# EasyEDA Pro project color-spu-strip-1.1-1019.eprj

# Schematic Schematic1
Create Date: 2022-10-02; Page Name: P1; Project Name: color-spu-strip-1.0; Schematic Name: Schematic1; Update Date: 2022-10-12; Company: 嘉立创EDA; Drawed: jlywxy; Page Size: A4; Reviewed: jlywxy; Version: V1.0
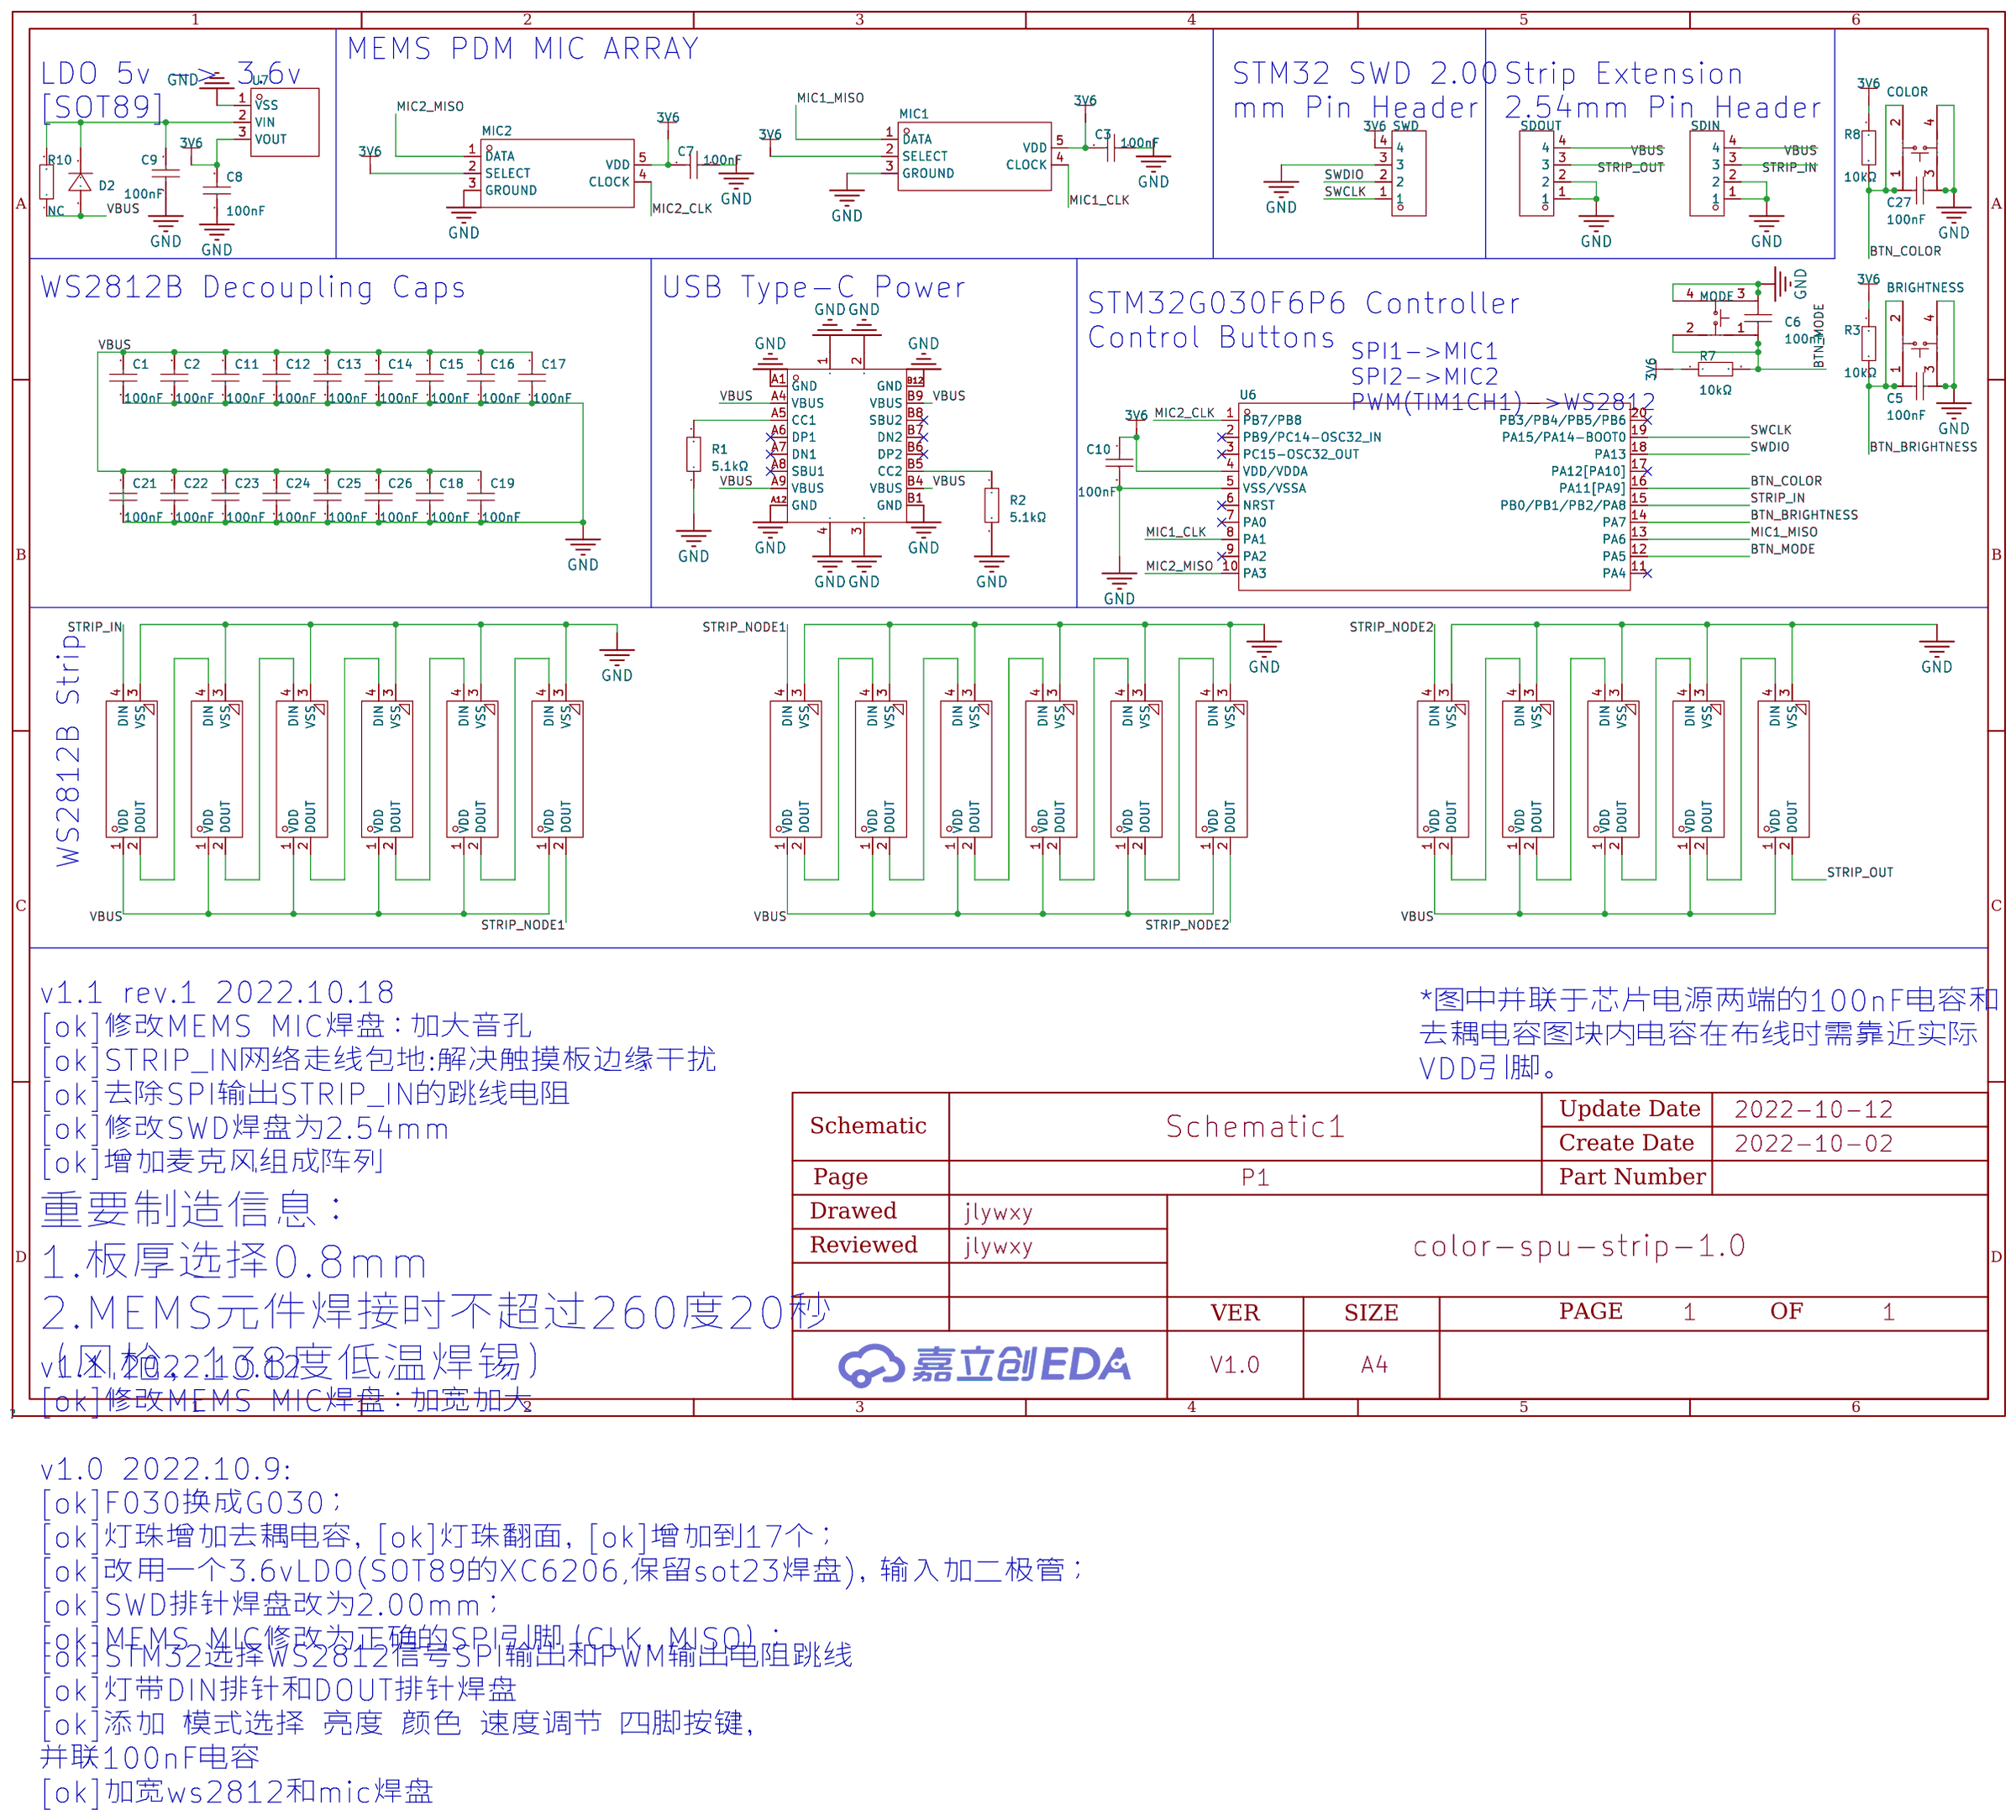
[diagram p0: schematic sheet]

## Parts
BRIGHTNESS  SKRPABE010  [KEY-SMD_4P-L4.2-W3.2-P2.20-LS4.6]
C1  100nF  [C0402]
C2  100nF  [C0402]
C3  100nF  [C0402]
C5  100nF  [C0402]
C6  100nF  [C0402]
C7  100nF  [C0402]
C8  100nF  [C0402]
C9  100nF  [C0402]
C10  100nF  [C0402]
C11  100nF  [C0402]
C12  100nF  [C0402]
C13  100nF  [C0402]
C14  100nF  [C0402]
C15  100nF  [C0402]
C16  100nF  [C0402]
C17  100nF  [C0402]
C18  100nF  [C0402]
C19  100nF  [C0402]
C21  100nF  [C0402]
C22  100nF  [C0402]
C23  100nF  [C0402]
C24  100nF  [C0402]
C25  100nF  [C0402]
C26  100nF  [C0402]
C27  100nF  [C0402]
COLOR  SKRPABE010  [KEY-SMD_4P-L4.2-W3.2-P2.20-LS4.6]
D2  M7  [DO-214AC_L4.3-W2.7-LS5.3-RD]
LED1  WS2812B-B  [LED-SMD_4P-L5.0-W5.0-TL_WS2812B-B]
LED2  WS2812B-B  [LED-SMD_4P-L5.0-W5.0-TL_WS2812B-B]
LED3  WS2812B-B  [LED-SMD_4P-L5.0-W5.0-TL_WS2812B-B]
LED4  WS2812B-B  [LED-SMD_4P-L5.0-W5.0-TL_WS2812B-B]
LED5  WS2812B-B  [LED-SMD_4P-L5.0-W5.0-TL_WS2812B-B]
LED6  WS2812B-B  [LED-SMD_4P-L5.0-W5.0-TL_WS2812B-B]
LED7  WS2812B-B  [LED-SMD_4P-L5.0-W5.0-TL_WS2812B-B]
LED8  WS2812B-B  [LED-SMD_4P-L5.0-W5.0-TL_WS2812B-B]
LED9  WS2812B-B  [LED-SMD_4P-L5.0-W5.0-TL_WS2812B-B]
LED10  WS2812B-B  [LED-SMD_4P-L5.0-W5.0-TL_WS2812B-B]
LED11  WS2812B-B  [LED-SMD_4P-L5.0-W5.0-TL_WS2812B-B]
LED12  WS2812B-B  [LED-SMD_4P-L5.0-W5.0-TL_WS2812B-B]
LED13  WS2812B-B  [LED-SMD_4P-L5.0-W5.0-TL_WS2812B-B]
LED14  WS2812B-B  [LED-SMD_4P-L5.0-W5.0-TL_WS2812B-B]
LED15  WS2812B-B  [LED-SMD_4P-L5.0-W5.0-TL_WS2812B-B]
LED16  WS2812B-B  [LED-SMD_4P-L5.0-W5.0-TL_WS2812B-B]
LED17  WS2812B-B  [LED-SMD_4P-L5.0-W5.0-TL_WS2812B-B]
MIC1  SPH0641LM4H-1  [MIC-SMD_5P_L3.5-W2.7-P0.82_SPH0641LU4H-1]
MIC2  SPH0641LM4H-1  [MIC-SMD_5P_L3.5-W2.7-P0.82_SPH0641LU4H-1]
MODE  SKRPABE010  [KEY-SMD_4P-L4.2-W3.2-P2.20-LS4.6]
R1  5.1kΩ  [R0603]
R2  5.1kΩ  [R0603]
R3  10kΩ  [R0603]
R7  10kΩ  [R0603]
R8  10kΩ  [R0603]
R10  NC  [R0603]
SDIN  M2510V-04P  [CONN-TH_M2510V-04P]
SDOUT  M2510V-04P  [CONN-TH_M2510V-04P]
SWD  M2510V-04P  [CONN-TH_M2510V-04P]
U2  20009-UCAF001-X  [TYPE-C-SMD_20009-UCAF001-X]
U6  STM32G030F6P6  [TSSOP-20_L6.5-W4.4-P0.65-LS6.4-BL]
U7  XC6206P362PR  [SOT-89-3_L4.5-W2.5-P1.50-LS4.2-BR]

## Library data of the parts
BRIGHTNESS COLOR MODE = SKRPABE010: 触点电流:50mA;额定电压(DC):16V;电路结构:单刀单掷;安装方式:立贴;按钮形状:椭圆形按钮;带灯:-;开关长度:4.2mm;开关宽度:3.2mm;开关高度:2.5mm;; LCSC Part Name: 3.2*4.2*2.5，1.57N; Supplier Part: C115360; Manufacturer: ALPSALPINE(阿尔卑斯阿尔派); Supplier Footprint: SMD; JLCPCB Part Class: Extended Part; Datasheet: https://atta.szlcsc.com/upload/public/pdf/source/20170620/1497944816225.pdf; Supplier: LCSC; Contact Current: 50mA; Voltage Rating (DC): 16V; Circuit: 单刀单掷; Mounting Style: 立贴; Actuator Style: 椭圆形按钮; Switch Length: 4.2mm; Switch Width: 3.2mm; Switch Height: 2.5mm
C1-C3 C5-C19 C21-C27 = CL05A105KP5NNNC: 容值:1uF;精度:±10%;额定电压:10V;材质(温度系数):X5R;; LCSC Part Name: 1uF ±10% 10V; Supplier Part: C14445; Manufacturer: SAMSUNG(三星); Supplier Footprint: 0402; JLCPCB Part Class: Extended Part; Datasheet: https://atta.szlcsc.com/upload/public/pdf/source/20160103/1457707670698.pdf; Supplier: LCSC; Tolerance: ±10%; Voltage Rated: 10V; Temperature Coefficient: X5R
D2 = M7_C95872: 二极管配置:-;直流反向耐压(Vr):1kV;平均整流电流(Io):1A;正向压降(Vf):1.1V@1A;反向电流(Ir):5A@1kV;; LCSC Part Name: 1kV 1A 1.1V@1A GPP; Supplier Part: C95872; Manufacturer: MDD; Supplier Footprint: SMA(DO-214AC); JLCPCB Part Class: Basic Part; Datasheet: https://atta.szlcsc.com/upload/public/pdf/source/20170221/1487670316366.pdf; Supplier: LCSC; Reverse Voltage (Vr): 1kV; Average Rectified Current (Io): 1A; Forward Voltage (Vf@If): 1.1V@1A; Reverse Leakage Current: 5A@1kV
LED1-LED17 = WS2812B-B: 发光颜色:RGB三色;; LCSC Part Name: RGB三色 （注意防潮，请查阅规格书中对应具体内容）; Supplier Part: C114586; Manufacturer: worldsemi; Supplier Footprint: 5050(mm); JLCPCB Part Class: Extended Part; Datasheet: https://atta.szlcsc.com/upload/public/pdf/source/20200615/C114586_26EB6813EC9F2A3F6C7FBB2AD75DE01F.pdf; Supplier: LCSC; Emitted Color: RGB三色
MIC1 MIC2 = SPH0641LM4H-1: Supplier Part: C497724; JLCPCB Part Class: Extended Part; Datasheet: https://atta.szlcsc.com/upload/public/pdf/source/20200318/C497724_6B11B238D0CA44BA5FB9A942A0F0F223.pdf; Supplier: LCSC
R1-R3 R7 R8 R10 = 0603WAF1002T5E: 电阻类型:厚膜电阻;阻值:10kΩ;精度:±1%;功率:100mW;温度系数:±100ppm/;最大工作电压:75V;工作温度范围:-55~+155;; LCSC Part Name: 10kΩ ±1% 100mW; Supplier Part: C25804; Manufacturer: UNI-ROYAL(厚声); Supplier Footprint: 0603; JLCPCB Part Class: Basic Part; Datasheet: https://atta.szlcsc.com/upload/public/pdf/source/20200306/C422600_1E6D84923E4A46A82E41ADD87F860B5C.pdf; Supplier: LCSC; Type: 厚膜电阻; Tolerance: ±1%; Power(Watts): 100mW; Temperature Coefficient: ±100ppm/; Overload Voltage (Max): 75V; Operating Temperature Range: -55~+155
SDIN SDOUT SWD = M2510V-04P: 参考系列:-;间距:2.54mm;插针结构:1x4P;排数:1;每排PIN数:4;行距:-;公母:公型插针;安装方式:直插;额定电流:3A;工作温度范围:-25~+85;; LCSC Part Name: 4P 2.54mm; Supplier Part: C2764792; Manufacturer: XFCN(台湾兴飞); Supplier Footprint: 插件,P=2.54mm; JLCPCB Part Class: Extended Part; Datasheet: https://atta.szlcsc.com/upload/public/pdf/source/20210810/3DC46818253F58AEF0903D89F89BDDDF.pdf; Supplier: LCSC; Pitch: 2.54mm; Pins Structure: 1x4P; Number of Rows: 1; Number of PINs Per Row: 4; Gender: 公型插针; Mounting Style: 直插; Current Rating (Max): 3A; Operating Temperature Range: -25~+85
U2 = 20009-UCAF001-X: TYPE C 16P母座板上 L=8.30; LCSC Part Name: TYPE C; Supplier Part: C3148200; Manufacturer: MINTRON(明硕); Supplier Footprint: SMD; JLCPCB Part Class: Extended Part; Datasheet: https://atta.szlcsc.com/upload/public/pdf/source/20220705/4C04992B6F70FB490BC74B4779796E6C.pdf; Supplier: LCSC
U6 = STM32G030F6P6: CPU位数:-;ROM类型:-;CPU内核:-;主频（MAX):-;工作电压:-;; Supplier Part: C724040; Manufacturer: ST(意法半导体); Supplier Footprint: TSSOP-20; JLCPCB Part Class: Extended Part; Datasheet: https://atta.szlcsc.com/upload/public/pdf/source/20200511/C529329_A1CB615556C746C4EA827FCAD1461480.pdf; Supplier: LCSC
U7 = XC6206P362PR: 输出类型:-;; Supplier Part: C545582; Manufacturer: UMW(友台半导体); Supplier Footprint: SOT-89; JLCPCB Part Class: Extended Part; Datasheet: https://atta.szlcsc.com/upload/public/pdf/source/20211011/2FF0EF86CD1346BC1578534D6C1D0E45.pdf; Supplier: LCSC

## Nets
3V6: C3.2 C7.2 C8.2 C10.1 MIC1.2(SELECT) MIC1.5(VDD) MIC2.2(SELECT) MIC2.5(VDD) R3.1 R7.1 R8.1 SWD.4 U6.4(VDD/VDDA) U7.3(VOUT)
GND: BRIGHTNESS.3 BRIGHTNESS.4 C1.1 C2.1 C3.1 C5.1 C6.1 C7.1 C8.1 C9.1 C10.2 C11.1 C12.1 C13.1 C14.1 C15.1 C16.1 C17.1 C18.1 C19.1 C21.1 C22.1 C23.1 C24.1 C25.1 C26.1 C27.1 COLOR.3 COLOR.4 LED1.3(VSS) LED2.3(VSS) LED3.3(VSS) LED4.3(VSS) LED5.3(VSS) LED6.3(VSS) LED7.3(VSS) LED8.3(VSS) LED9.3(VSS) LED10.3(VSS) LED11.3(VSS) LED12.3(VSS) LED13.3(VSS) LED14.3(VSS) LED15.3(VSS) LED16.3(VSS) LED17.3(VSS) MIC1.3(GROUND) MIC2.3(GROUND) MODE.3 MODE.4 R1.1 R2.2 SDIN.1 SDIN.2 SDOUT.1 SDOUT.2 SWD.3 U2.1 U2.2 U2.3 U2.4 U2.A1(GND) U2.A12(GND) U2.B1(GND) U2.B12(GND) U6.5(VSS/VSSA) U7.1(VSS)
VBUS: C1.2 C2.2 C11.2 C12.2 C13.2 C14.2 C15.2 C16.2 C17.2 C18.2 C19.2 C21.2 C22.2 C23.2 C24.2 C25.2 C26.2 D2.2(A) LED1.1(VDD) LED2.1(VDD) LED3.1(VDD) LED4.1(VDD) LED5.1(VDD) LED6.1(VDD) LED7.1(VDD) LED8.1(VDD) LED9.1(VDD) LED10.1(VDD) LED11.1(VDD) LED12.1(VDD) LED13.1(VDD) LED14.1(VDD) LED15.1(VDD) LED16.1(VDD) LED17.1(VDD) R10.1 SDIN.4 SDOUT.4 U2.A4(VBUS) U2.A9(VBUS) U2.B4(VBUS) U2.B9(VBUS)
BTN_BRIGHTNESS: BRIGHTNESS.1 BRIGHTNESS.2 C5.2 R3.2 U6.14(PA7)
BTN_COLOR: C27.2 COLOR.1 COLOR.2 R8.2 U6.16(PA11[PA9])
BTN_MODE: C6.2 MODE.1 MODE.2 R7.2 U6.12(PA5)
MIC1_CLK: MIC1.4(CLOCK) U6.8(PA1)
MIC1_MISO: MIC1.1(DATA) U6.13(PA6)
MIC2_CLK: MIC2.4(CLOCK) U6.1(PB7/PB8)
MIC2_MISO: MIC2.1(DATA) U6.10(PA3)
STRIP_IN: LED1.4(DIN) SDIN.3 U6.15(PB0/PB1/PB2/PA8)
STRIP_NODE1: LED6.2(DOUT) LED7.4(DIN)
STRIP_NODE2: LED12.2(DOUT) LED13.4(DIN)
STRIP_OUT: LED17.2(DOUT) SDOUT.3
SWCLK: SWD.1 U6.19(PA15/PA14-BOOT0)
SWDIO: SWD.2 U6.18(PA13)
$1N8535: R1.2 U2.A5(CC1)
$1N8835: R2.1 U2.B5(CC2)
$1N25428: LED1.2(DOUT) LED2.4(DIN)
$1N25469: LED2.2(DOUT) LED3.4(DIN)
$1N25510: LED3.2(DOUT) LED4.4(DIN)
$1N25551: LED4.2(DOUT) LED5.4(DIN)
$1N25592: LED5.2(DOUT) LED6.4(DIN)
$1N26919: LED7.2(DOUT) LED8.4(DIN)
$1N26920: LED8.2(DOUT) LED9.4(DIN)
$1N26921: LED9.2(DOUT) LED10.4(DIN)
$1N26922: LED10.2(DOUT) LED11.4(DIN)
$1N26923: LED11.2(DOUT) LED12.4(DIN)
$1N28420: LED13.2(DOUT) LED14.4(DIN)
$1N28421: LED14.2(DOUT) LED15.4(DIN)
$1N28422: LED15.2(DOUT) LED16.4(DIN)
$1N28423: LED16.2(DOUT) LED17.4(DIN)
$1N125570: C9.2 D2.1(K) R10.2 U7.2(VIN)

Not connected (* = marked no-connect by the designer): U2 A6(DP1)* A7(DN1)* A8(SBU1)* B6(DP2)* B7(DN2)* B8(SBU2)*; U6 2(PB9/PC14-OSC32_IN)* 3(PC15-OSC32_OUT)* 6(NRST)* 7(PA0)* 9(PA2)* 11(PA4)* 17(PA12[PA10])* 20(PB3/PB4/PB5/PB6)*

## Notes on the sheet
- LDO 5v -> 3.6v
  [SOT89]
- MEMS PDM MIC ARRAY
- STM32 SWD 2.00
  mm Pin Header
- Strip Extension
  2.54mm Pin Header
- WS2812B Decoupling Caps
- USB Type-C Power
- STM32G030F6P6 Controller
  Control Buttons
- SPI1->MIC1
  SPI2->MIC2
  PWM(TIM1CH1)->WS2812
- WS2812B Strip
- v1.1 rev.1 2022.10.18
  [ok]修改MEMS MIC焊盘：加大音孔
  [ok]STRIP_IN网络走线包地:解决触摸板边缘干扰
  [ok]去除SPI输出STRIP_IN的跳线电阻
  [ok]修改SWD焊盘为2.54mm
  [ok]增加麦克风组成阵列
- *图中并联于芯片电源两端的100nF电容和
  去耦电容图块内电容在布线时需靠近实际
  VDD引脚。
- 重要制造信息：
  1.板厚选择0.8mm
  2.MEMS元件焊接时不超过260度20秒
  （风枪，138度低温焊锡）
- v1.1 2022.10.12
  [ok]修改MEMS MIC焊盘：加宽加大
- v1.0 2022.10.9:
  [ok]F030换成G030；
  [ok]灯珠增加去耦电容，[ok]灯珠翻面，[ok]增加到17个；
  [ok]改用一个3.6vLDO(SOT89的XC6206,保留sot23焊盘)，输入加二极管；
  [ok]SWD排针焊盘改为2.00mm；
  [ok]MEMS MIC修改为正确的SPI引脚（CLK，MISO）；
- [ok]STM32选择WS2812信号SPI输出和PWM输出电阻跳线
  [ok]灯带DIN排针和DOUT排针焊盘
  [ok]添加 模式选择 亮度 颜色 速度调节 四脚按键，
  并联100nF电容
  [ok]加宽ws2812和mic焊盘

# Board PCB1
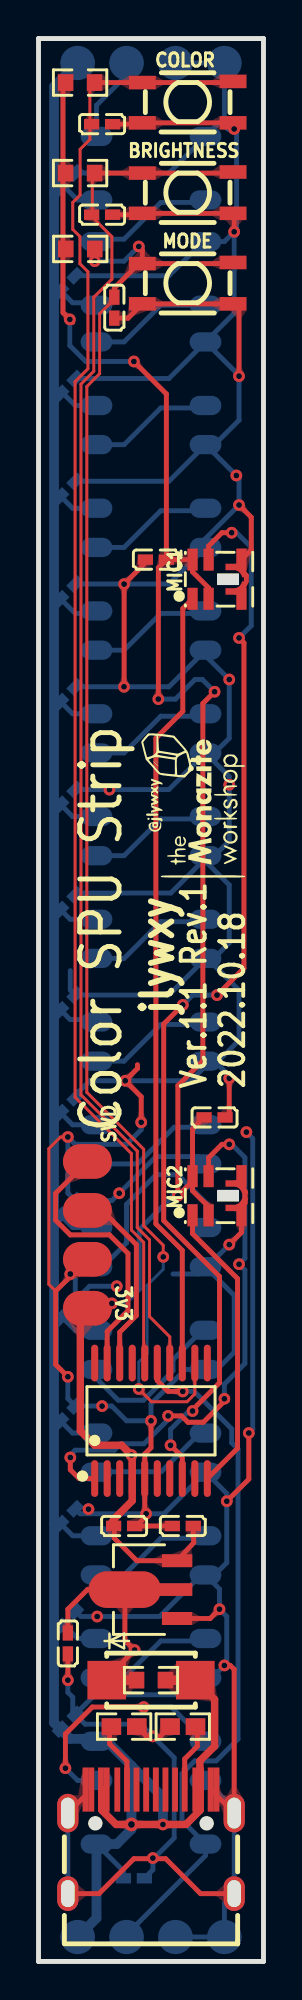
[diagram p1: board, top side]
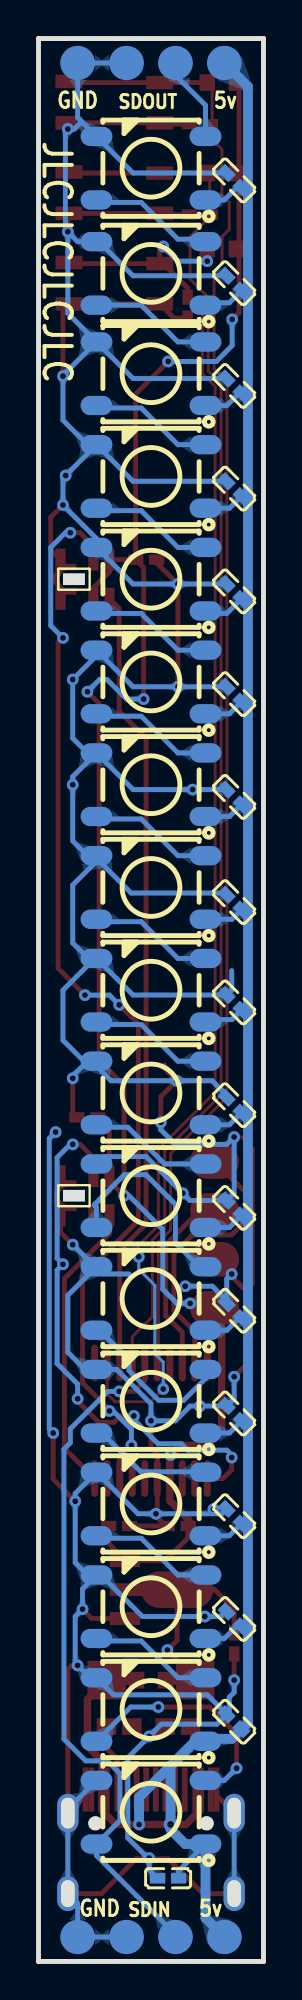
[diagram p2: board, bottom side, seen from below]

Outline 11.68 x 99.82 mm; copper layers: Top Layer, Bottom Layer. Coordinates in mm from the lower left corner of the outline.
Outline path: 0,99.82 0,0 arc(0,0) 0,0 11.68,0 arc(11.68,0) 11.68,0 11.68,99.82 arc(11.68,99.82) 11.68,99.82 0,99.82 arc(0,99.82) 0,99.82
Stack: Top Layer 0.035mm / Dielectric1 1.51mm FR4 er 4.5 / Bottom Layer 0.035mm

## Design rules (mm)
spacing safeClearance (default): track to track 0.152, other pairs 0.152 to 0.3
track width trackWidth (default): min 0.127, default 0.254, max 2.54
differential pair differentialPair (default): width min 0.127, default 0.254, max 2.54; gap min 0.152, default 0.152
via viaSize (default): diameter min 0.5, default 0.61, max 10; hole min 0.3, default 0.305, max 6

## Placement (name value [footprint] x y rotation side)
BRIGHTNESS  SKRPABE010  [KEY-SMD_4P-L4.2-W3.2-P2.20-LS4.6]  7.75 91.82 0 top
C1  100nF  [C0402]  1.52 87.12 225 bottom
C2  100nF  [C0402]  1.52 81.79 225 bottom
C3  100nF  [C0402]  6.1 72.77 0 top
C5  100nF  [C0402]  3.3 90.68 180 top
C6  100nF  [C0402]  3.94 85.85 90 top
C7  100nF  [C0402]  9.14 43.82 180 top
C8  100nF  [C0402]  7.49 22.61 0 top
C9  100nF  [C0402]  1.52 16.51 90 top
C10  100nF  [C0402]  4.44 22.61 0 top
C11  100nF  [C0402]  1.52 71.12 225 bottom
C12  100nF  [C0402]  1.52 54.99 225 bottom
C13  100nF  [C0402]  1.52 44.45 225 bottom
C14  100nF  [C0402]  1.52 33.78 225 bottom
C15  100nF  [C0402]  1.52 23.11 225 bottom
C16  100nF  [C0402]  1.52 12.45 225 bottom
C17  100nF  [C0402]  4.95 4.32 180 bottom
C18  100nF  [C0402]  1.52 28.45 225 bottom
C19  100nF  [C0402]  1.52 17.78 225 bottom
C21  100nF  [C0402]  1.52 92.46 225 bottom
C22  100nF  [C0402]  1.52 76.45 225 bottom
C23  100nF  [C0402]  1.52 65.79 225 bottom
C24  100nF  [C0402]  1.52 60.45 225 bottom
C25  100nF  [C0402]  1.52 49.78 225 bottom
C26  100nF  [C0402]  1.52 39.12 225 bottom
C27  100nF  [C0402]  3.3 95.38 180 top
COLOR  SKRPABE010  [KEY-SMD_4P-L4.2-W3.2-P2.20-LS4.6]  7.75 96.52 0 top
D2  M7  [DO-214AC_L4.3-W2.7-LS5.3-RD]  5.84 14.61 0 top
LED1  WS2812B-B  [LED-SMD_4P-L5.0-W5.0-TL_WS2812B-B]  5.84 7.75 0 bottom
LED2  WS2812B-B  [LED-SMD_4P-L5.0-W5.0-TL_WS2812B-B]  5.84 13.08 0 bottom
LED3  WS2812B-B  [LED-SMD_4P-L5.0-W5.0-TL_WS2812B-B]  5.84 18.42 0 bottom
LED4  WS2812B-B  [LED-SMD_4P-L5.0-W5.0-TL_WS2812B-B]  5.84 23.75 0 bottom
LED5  WS2812B-B  [LED-SMD_4P-L5.0-W5.0-TL_WS2812B-B]  5.84 29.08 0 bottom
LED6  WS2812B-B  [LED-SMD_4P-L5.0-W5.0-TL_WS2812B-B]  5.84 34.42 0 bottom
LED7  WS2812B-B  [LED-SMD_4P-L5.0-W5.0-TL_WS2812B-B]  5.84 39.75 0 bottom
LED8  WS2812B-B  [LED-SMD_4P-L5.0-W5.0-TL_WS2812B-B]  5.84 45.09 0 bottom
LED9  WS2812B-B  [LED-SMD_4P-L5.0-W5.0-TL_WS2812B-B]  5.84 50.42 0 bottom
LED10  WS2812B-B  [LED-SMD_4P-L5.0-W5.0-TL_WS2812B-B]  5.84 55.75 0 bottom
LED11  WS2812B-B  [LED-SMD_4P-L5.0-W5.0-TL_WS2812B-B]  5.84 61.09 0 bottom
LED12  WS2812B-B  [LED-SMD_4P-L5.0-W5.0-TL_WS2812B-B]  5.84 66.42 0 bottom
LED13  WS2812B-B  [LED-SMD_4P-L5.0-W5.0-TL_WS2812B-B]  5.84 71.76 0 bottom
LED14  WS2812B-B  [LED-SMD_4P-L5.0-W5.0-TL_WS2812B-B]  5.84 77.09 0 bottom
LED15  WS2812B-B  [LED-SMD_4P-L5.0-W5.0-TL_WS2812B-B]  5.84 82.42 0 bottom
LED16  WS2812B-B  [LED-SMD_4P-L5.0-W5.0-TL_WS2812B-B]  5.84 87.63 0 bottom
LED17  WS2812B-B  [LED-SMD_4P-L5.0-W5.0-TL_WS2812B-B]  5.84 93.09 0 bottom
MIC1  SPH0641LM4H-1  [MIC-SMD_5P_L3.5-W2.7-P0.82_SPH0641LU4H-1]  9.27 71.76 90 top
MIC2  SPH0641LM4H-1  [MIC-SMD_5P_L3.5-W2.7-P0.82_SPH0641LU4H-1]  9.27 39.75 90 top
MODE  SKRPABE010  [KEY-SMD_4P-L4.2-W3.2-P2.20-LS4.6]  7.75 87.12 0 top
R1  5.1kΩ  [R0603]  4.44 12.19 180 top
R2  5.1kΩ  [R0603]  7.49 12.19 180 top
R3  10kΩ  [R0603#2]  2.16 92.84 0 top
R7  10kΩ  [R0603#2]  2.17 88.9 0 top
R8  10kΩ  [R0603#2]  2.16 97.54 0 top
R10  NC  [R0603#2]  5.84 14.61 180 top
SDIN  M2510V-04P  [CONN-TH_M2510V-04P#2]  5.84 1.27 0 bottom
SDOUT  M2510V-04P  [CONN-TH_M2510V-04P#2]  5.84 98.55 0 bottom
SWD  M2510V-04P  [CONN-TH_M2510V-04P]  2.54 37.72 90 top
U2  20009-UCAF001-X  [TYPE-C-SMD_20009-UCAF001-X]  5.84 6.1 0 top
U6  STM32G030F6P6  [TSSOP-20_L6.5-W4.4-P0.65-LS6.4-BL]  5.84 28.07 0 top
U7  XC6206P362PR  [SOT-89-3_L4.5-W2.5-P1.50-LS4.2-BR]  5.84 19.3 0 top

## Footprints (pads in the part's own frame, mm; a bottom-side part is the same pattern mirrored in y, then rotated)
C0402
  rect 0.79x0.54 smd: 1(-0.545,0) 2(0.545,0)
CONN-TH_M2510V-04P
  oval 1.801x2.54 smd: 1(3.81,0) 2(1.27,0) 3(-1.27,0) 4(-3.81,0)
CONN-TH_M2510V-04P#2
  rrect 1.801x1.778 smd: 1(3.81,0) 2(1.27,0) 3(-1.27,0) 4(-3.81,0)
DO-214AC_L4.3-W2.7-LS5.3-RD
  rect 1.999x1.999 smd: 1(-2.299,0) 2(2.301,0)
KEY-SMD_4P-L4.2-W3.2-P2.20-LS4.6
  rect 1.397x0.701 smd: 1(-2.354,1.016) 2(2.354,1.075) 3(-2.354,-1.075) 4(2.354,-1.075)
LED-SMD_4P-L5.0-W5.0-TL_WS2812B-B
  rrect 1.651x1 smd: 1(-2.831,1.65) 2(-2.831,-1.65) 3(2.831,-1.65) 4(2.831,1.65)
MIC-SMD_5P_L3.5-W2.7-P0.82_SPH0641LU4H-1
  rect 1.143x0.53 smd: 1(-1.016,1.27) 2(-1.016,0.438) 3(-1.016,-1.27) 3(1.016,-1.27) 4(1.016,0.438) 5(1.016,1.27)
  rect 0.33x0.889 smd: 3(-0.635,-0.889) 3(0.635,-0.889)
  custom 0.696x0.705 smd: 3(-0.459,-1.25)
  custom 0.704x0.696 smd: 3(0.453,-1.26)
R0603
  rect 1.016x0.864 smd: 1(-0.66,0) 2(0.66,0)
R0603#2
  rect 0.806x0.864 smd: 1(-0.753,0) 2(0.753,0)
SOT-89-3_L4.5-W2.5-P1.50-LS4.2-BR
  rect 1.575x0.672 smd: 1(1.356,-1.5) 3(1.356,1.5)
  custom 5.377x1.9 smd: 2(-1.356,0)
TSSOP-20_L6.5-W4.4-P0.65-LS6.4-BL
  oval 0.364x1.905 smd: 1(-2.925,-2.998) 2(-2.275,-2.998) 3(-1.625,-2.998) 4(-0.975,-2.998) 5(-0.325,-2.998) 6(0.325,-2.998) 7(0.975,-2.998) 8(1.625,-2.998) 9(2.275,-2.998) 10(2.925,-2.998) 11(2.925,2.998) 12(2.275,2.998) 13(1.625,2.998) 14(0.975,2.998) 15(0.325,2.998) 16(-0.325,2.998) 17(-0.975,2.998) 18(-1.625,2.998) 19(-2.275,2.998) 20(-2.925,2.998)
TYPE-C-SMD_20009-UCAF001-X
  oval 1.1x2 hole 0.7x1.6: 1(-4.32,1.606) 2(4.32,1.606)
  oval 1.1x1.8 hole 0.7x1.4: 3(4.32,-2.574) 4(-4.32,-2.574)
  rect 0.3x2.286 smd: A1(-3.4,2.827) A4(-2.6,2.827) A5(-1.25,2.827) A6(-0.25,2.827) A7(0.25,2.827) A8(1.25,2.828) A9(2.6,2.828) A12(3.4,2.827) B1(3.1,2.827) B4(2.3,2.828) B5(1.75,2.827) B6(0.75,2.827) B7(-0.75,2.827) B8(-1.75,2.828) B9(-2.3,2.827) B12(-3.1,2.827)

## Nets
As in the schematic.

Pads without a net: U2 A6 A7 A8 B6 B7 B8; U6 2 3 6 7 9 11 17 20

## Via types
v1: diameter 0.61, hole 0.305, Top Layer to Bottom Layer, 59 vias
v2: diameter 0.711, hole 0.355, Top Layer to Bottom Layer, 1 via

## Routing (per net, layer and track width the routed paths; a pad name or vN(x,y) marks a point on that pad's centre or on a via; arc(x,y) is an arc through that point)
3V6: length 104.6
  Top Layer w0.254: C3.2 6.22,72.35 v1(6.22,65.53) ; C3.2 MIC1.5 8,72.14 8.83,71.3 8.83,71.15 ; C3.2 6.64,81.37 v1(4.95,83.06) ; C7.2 8,43.22 8,40.51 ; 3.77,22.86 3.94,22.7 3.94,21.97 5.1,20.8 U7.3 8.06,21.74 8.04,22.39 ; 8,40.51 v1(7.24,39.75) 7.24,45.47 8.53,46.76 8.53,65.3 v1(9.14,65.91) ; 8,40.51 8,40.01 8.83,39.17 8.83,38.61 ; 1.78,85.09 1.27,85.6 1.27,97.4 R8.1 ; v1(4.83,26.29) 4.87,26.33
  Top Layer w0.381: 2.16,33.7 2.17,33.69 2.17,27.55 2.92,26.8 4.32,26.8 4.78,26.33 4.87,26.33 U6.4 4.87,23.92 3.9,22.95 C10.1
  Bottom Layer w0.254: v1(6.22,65.53) 7.11,65.53 8.13,66.55 8.51,66.55 v1(9.14,65.91) ; v1(1.63,85.24) 1.63,83.88 2.45,83.06 v1(4.95,83.06) ; v1(3.81,34.16) 4.5,34.16 5.23,34.9 5.23,38 6.98,39.75 v1(7.24,39.75)
GND: length 361.4
  Top Layer w0.152: 0.89,34.8 0.53,35.15 0.53,42.19 1.14,42.8 v1(1.52,42.8)
  Top Layer w0.254: v1(9.91,45.85) 9.91,44.03 9.69,43.82 ; C6.1 4.65,85.31 MODE.3 MODE.4 10.41,85.74 v1(10.41,82.3) ; 10.16,3.52 8.42,3.52 6.6,5.33 4.95,5.33 3.14,3.52 1.52,3.52 ; v1(1.65,35.69) 2.54,36.58 2.54,36.83 ; v1(9.78,23.89) 10.92,25.04 v1(10.92,27.43) ; COLOR.4 COLOR.3 5.32,95.38 3.72,95.38 ; 5.55,72.77 5.55,72.61 v1(4.44,71.5) 4.44,66.18 v1(4.44,66.17) ; v1(9.91,37.21) 10.54,37.85 10.54,38.61 ; v1(9.65,15.37) 9.96,15.37 10.16,15.16 U2.2 U2.B1 ; C9.1 v1(1.52,14.61) ; v1(1.52,30.35) 0.89,30.99 0.89,34.8 1.79,35.7 2.16,35.7 ; v1(10.16,89.79) 10.16,90.69 BRIGHTNESS.4 BRIGHTNESS.3 5.32,90.68 3.97,90.68 ; R1.1 5.61,11.68 v1(5.94,11.68) 6.32,11.68 R2.2 ; v1(10.41,75.61) 11.05,74.97 11.05,73.28 MIC1.3 ; 10.72,39.99 10.72,39.37 10.52,39.17 ; v1(5.84,28.07) 5.84,26.67 5.52,26.35 U6.5 5.52,23.04 5.08,22.61 C8.1 ; v1(5.33,43.56) 5.33,44.89 v1(4.5,45.72) 5.14,46.36 5.14,46.55 ; U7.1 8.91,17.8 v1(9.4,18.29) ; U2.A1 2.44,8.62 U2.1 ; MIC1.3 10.79,71.94 10.79,71.63
  Bottom Layer w0.254: 8.55,51.94 6.77,50.17 C25.1 1.65,50.43 1.65,51.44 ; 8.55,51.94 8.51,51.94 ; 8.55,51.94 8.67,52.07 ; 8.55,51.94 8.89,51.94 ; v1(10.16,89.79) 9.65,89.28 8.67,89.28 ; v1(10.16,89.79) 10.29,89.92 10.29,95 10.16,95.12 ; v1(10.16,89.79) 10.16,85.56 8.67,84.07 10.41,82.33 10.41,80.01 9.14,78.74 8.67,78.74 10.41,77 v1(10.41,75.61) 8.67,73.87 8.67,73.41 ; v1(9.91,37.21) 8.76,36.07 8.67,36.07 ; 9.14,46.55 10.41,47.82 10.41,50.42 8.89,51.94 ; 9.14,46.55 8.86,46.55 ; 9.14,46.55 9.33,46.55 9.91,45.97 v1(9.91,45.85) ; 8.74,46.55 8.67,46.55 ; 8.74,46.55 8.8,46.61 ; 8.74,46.55 8.86,46.55 ; 8.74,46.55 7.91,45.72 v1(4.5,45.72) 2.67,45.72 1.91,44.96 C13.1 ; 8.67,52.16 8.89,51.94 ; 8.89,51.94 8.98,51.94 9.91,52.87 9.91,55.88 8.6,57.19 ; 8.55,25.27 6.51,23.24 v1(5.59,23.24) 2.17,23.24 C15.1 ; 1.91,34.31 C14.1 ; 1.91,34.31 2.65,35.05 v1(4.06,35.05) ; 1.91,34.31 1.91,35.43 v1(1.65,35.69) ; 1.81,18.3 2.21,17.91 v1(3.05,17.91) 6.28,17.91 8.45,20.08 ; C22.1 6.77,76.84 8.55,78.61 ; 1.52,3.52 U2.1 ; 8.67,41.4 8.29,41.78 6.1,41.78 v1(4.19,39.88) 3.81,39.5 C26.1 1.52,39.89 v1(1.52,42.8) 1.91,42.42 4.57,42.42 5.33,43.18 v1(5.33,43.56) ; 8.67,68.07 8.67,67.78 v1(9.91,66.55) 9.91,63.5 9.14,62.74 8.67,62.74 9.91,61.5 v1(9.91,61.09) 9.91,58.17 9.14,57.4 8.67,57.4 ; 8.84,14.57 8.67,14.73 7.78,13.84 2.92,13.84 C16.1 ; 8.84,14.57 8.85,14.57 9.78,15.49 9.78,17.91 v1(9.4,18.29) 9.4,19.33 8.83,19.9 ; 8.84,14.57 8.83,14.57 ; 8.67,46.74 8.8,46.61 ; 8.8,46.61 8.83,46.64 ; 8.8,46.61 8.86,46.55 ; 2.01,55.46 6.87,55.46 8.6,57.19 ; 8.67,36.07 10.16,34.58 10.16,31.62 9.27,30.73 7.62,30.73 5.84,28.95 v1(5.84,28.07) 4.57,28.07 3.81,28.83 C18.1 1.52,29.22 v1(1.52,30.35) ; 8.67,36.07 8.29,35.69 6.98,35.69 ; v1(4.44,71.5) 4.44,71.51 ; 4.44,71.51 6.77,71.51 8.55,73.28 ; 4.44,71.51 C11.1 ; v1(10.92,27.43) 11.13,27.64 11.13,42.72 v1(10.79,43.05) ; 8.6,57.19 8.64,57.24 ; 8.6,57.19 8.51,57.28 ; C16.1 1.78,12.96 1.78,13.72 1.52,13.97 v1(1.52,14.61) ; C16.1 2.42,12.32 5.3,12.32 v1(5.94,11.68) 7.05,10.58 7.05,6.41 6,5.37 v1(5.94,5.37) 5.94,4.76 C17.1 ; 9.44,95.51 9.82,95.13 v1(10.16,95.13) ; 9.44,95.51 8.67,94.74 ; 9.44,95.51 9.65,95.72 SDOUT.1 SDOUT.2 ; 8.55,62.61 6.77,60.83 v1(3.68,60.83) 1.91,60.83 C24.1 ; 8.55,83.95 6.77,82.17 C2.1 ; 8.55,67.95 6.77,66.17 v1(4.44,66.17) C23.1 ; 8.55,89.28 6.77,87.51 C1.1 ; SDIN.2 SDIN.1 9.65,3.01 10.16,3.52 U2.2 10.16,7.91 8.67,9.4 ; 8.67,20.06 9.14,20.06 9.78,20.7 v1(9.78,23.89) 9.78,24.29 8.67,25.4 ; 8.55,94.62 6.77,92.84 C21.1
  vias: v1(2.59,23.48) v1(3.3,28.83) v1(10.27,77.14)
VBUS: length 156.7
  Top Layer w0.381: 8.38,8.86 8.38,7.84 7.66,7.11 v1(6.46,7.11) v2(4.83,7.11) 4.03,7.11 3.3,7.84 3.3,8.92 ; 8.38,9.16 8.38,10.41 9.14,11.18 9.14,13.6 D2.2
  Top Layer w0.508: R10.1 D2.2
  Bottom Layer w0.254: C19.2 1.4,17.39 2.03,16.76 3.01,16.76 ; C24.2 1.77,59.44 3.01,59.44 ; C13.2 1.77,43.43 LED8.1 ; C22.2 1.77,75.44 LED14.1 ; 3.01,6.1 4.41,4.7 C17.2 ; LED10.1 1.64,54.1 C12.2 ; C11.2 1.15,70.73 1.91,69.98 2.88,69.98 LED13.1 ; 3.01,27.43 1.77,27.43 C18.2 ; 1.15,22.73 1.78,22.1 LED4.1 ; LED12.1 1.77,64.77 C23.2 ; 3.01,38.1 1.77,38.1 C26.2 ; 3.01,80.77 1.91,80.77 1.27,81.4 C2.2 ; LED6.1 1.91,32.77 1.27,33.4 C14.2 ; 3.01,86.11 1.77,86.11 C1.2 ; LED9.1 2.88,48.9 1.64,48.9 C25.2 ; C21.2 1.4,92.07 2.03,91.44 LED17.1
  Bottom Layer w0.508: 4.83,10.16 3.55,11.43 LED2.1 2.88,11.56 1.64,11.56 C16.2 0.81,12.39 0.81,22.73 ; 4.83,10.16 4.83,6.86 4.06,6.1 3.01,6.1 ; 4.83,10.16 6.46,8.52 v1(6.46,7.11) ; LED1.1 3.01,2.25 SDIN.4 ; 0.81,22.73 C15.2 ; 0.81,22.73 0.81,91.74 ; 0.81,91.74 0.81,97.33 SDOUT.4 ; 0.81,91.74 C21.2
BTN_BRIGHTNESS: length 72
  Top Layer w0.152: 6.82,31.19 6.82,32.43 5.77,33.48 5.77,37.46 5.13,38.1 5.13,42.07 2.2,44.99 2.2,81.88 2.87,82.55 2.87,86.39 3.81,87.33 3.81,89.54 2.79,90.55 2.79,92.84
  Top Layer w0.254: BRIGHTNESS.2 10.04,92.84 BRIGHTNESS.1 2.79,92.84
BTN_COLOR: length 76.2
  Top Layer w0.152: 2.67,97.54 2.67,94.58 2.16,94.07 2.16,91.69 1.78,91.31 1.78,89.92 2.15,89.54 2.15,88.13 2.57,87.72 2.57,82.68 1.9,82.01 1.9,44.86 4.82,41.94 4.82,37.97 5.46,37.33 5.46,31.25
  Top Layer w0.254: COLOR.2 10.04,97.54 COLOR.1 2.67,97.54
BTN_MODE: length 75.9
  Top Layer w0.152: v1(6.48,36.58) 6.48,37.18 5.46,38.2 5.46,42.16 2.51,45.12 2.51,81.76 3.17,82.42 3.17,85.53 3.94,86.3 C6.2 ; 8.12,31.19 8.12,29.46 7.71,29.06 5.87,29.06 v1(5.21,29.72)
  Top Layer w0.254: R7.2 v1(2.92,88.27) ; 5.39,88.14 5.21,88.14 3.94,86.87 C6.2 ; 5.39,88.14 10.04,88.14 MODE.2 ; 5.39,88.14 5.39,88.84 v1(5.21,89.03)
  Bottom Layer w0.152: v1(6.48,36.58) 6.48,35.93 5.64,35.1 5.64,31.55 5.21,31.12 v1(5.21,29.72)
  Bottom Layer w0.254: v1(2.92,88.27) 4.44,88.27 v1(5.21,89.03)
MIC1_CLK: length 57.3
  Top Layer w0.254: v1(8,28.58) 8,28.64 9.4,30.04 9.4,35.56 6.5,38.46 6.5,48.67 v1(7.49,49.66) ; v1(10.03,74.17) 9.52,74.17 8.83,73.48 MIC1.4 ; U6.8 7.47,26.19 v1(6.86,26.8) ; v1(10.41,68.71) 10.67,68.45 10.67,51.56 v1(9.27,50.17)
  Bottom Layer w0.254: v1(10.41,68.71) 11.05,69.34 11.05,73.41 10.29,74.17 v1(10.03,74.17) ; v1(9.27,50.17) 8,50.17 v1(7.49,49.66) ; v1(8,28.58) 7.81,28.58 6.86,27.62 v1(6.86,26.8)
MIC1_MISO: length 41
  Top Layer w0.254: U6.13 7.47,36.92 6.1,38.29 6.1,63.5 7.49,64.9 7.49,70.23 MIC1.1
MIC2_CLK: length 28.5
  Top Layer w0.254: v1(6.73,28.32) 7.43,28.32 7.76,27.99 8.56,27.99 9.65,29.08 v1(9.65,29.21) ; MIC2.4 8.83,41.73 9.52,42.42 v1(9.91,42.42) ; 2.92,25.07 2.11,25.07 1.65,25.53 v1(1.65,26.16)
  Bottom Layer w0.254: v1(9.65,29.21) 9.65,29.97 10.72,31.04 10.72,35.89 v1(10.41,36.2) 10.72,36.5 10.72,41.73 10.03,42.42 v1(9.91,42.42) ; v1(6.73,28.32) 6.73,28.13 5.47,26.87 4.27,26.87 3.94,26.54 1.91,26.54 1.65,26.29 v1(1.65,26.16)
MIC2_MISO: length 15.3
  Top Layer w0.254: MIC2.1 8,37.78 10.34,35.45 10.34,26.64 U6.10
STRIP_IN: length 36.6
  Top Layer w0.254: v1(7.49,29.59) 6.73,29.59 6.17,30.16 6.17,31.32
  Bottom Layer w0.254: v1(7.49,29.59) 8.09,29.59 10.03,27.65 10.03,26.92 10.36,26.59 10.36,11.55 9.23,10.41 8.12,10.41 7.45,9.75 7.45,7.32 8.67,6.1 8.67,5.5 4.57,1.4 SDIN.3
STRIP_NODE1: length 10.8
  Bottom Layer w0.254: LED6.2 3.34,36.07 4.57,37.3 4.57,39.31 6.11,40.84 7.23,40.84 8.76,39.31 8.76,39.24 8.67,39.15 8.67,38.1
STRIP_NODE2: length 6.5
  Bottom Layer w0.254: 8.67,70.11 8.54,69.98 6.35,69.98 4.44,68.07 LED12.2
STRIP_OUT: length 4.5
  Bottom Layer w0.254: LED17.2 3.01,96.36 4.57,97.92 SDOUT.3
SWCLK: length 14.1
  Top Layer w0.254: SWD.1 0.89,39.88 0.89,38.48 1.65,37.72 3.68,37.72 4.65,36.75 4.65,33.78 3.57,32.7 3.57,31.32
SWDIO: length 9.5
  Top Layer w0.254: SWD.2 3.3,38.99 5.08,37.21 5.08,33.53 4.22,32.67 4.22,31.32
$1N8535: length 3.7
  Top Layer w0.254: U2.A5 4.59,10.39 3.69,11.29 3.69,12.1 R1.2
$1N8835: length 3.6
  Top Layer w0.254: U2.B5 7.59,10.51 8.25,11.17 8.25,12.1 R2.1
$1N25428: length 12.2
  Top Layer w0.254: v1(5.46,13.21) 2.79,13.21 1.4,11.81 v1(1.4,10.03)
  Bottom Layer w0.254: 8.67,11.43 6.9,13.21 v1(5.46,13.21) ; v1(1.4,10.03) 2.03,9.4 LED1.2
$1N25469: length 6.5
  Bottom Layer w0.254: 8.67,16.77 8.54,16.64 6.35,16.64 4.44,14.73 LED2.2
$1N25510: length 6.5
  Bottom Layer w0.254: LED3.2 4.44,20.06 6.35,21.97 8.54,21.97 8.67,22.1
$1N25551: length 6.5
  Bottom Layer w0.254: 3.44,25.42 6.37,25.42 8.28,27.33 8.97,27.33 9.1,27.46
$1N25592: length 8.4
  Bottom Layer w0.254: LED5.2 3.01,30.26 4.14,29.13 5.45,29.13 6.98,30.67 6.98,31.24 8.51,32.77 8.67,32.77
$1N26919: length 6.5
  Bottom Layer w0.254: LED7.2 5.14,41.4 7.05,43.31 8.54,43.31 8.67,43.44
$1N26920: length 6.5
  Bottom Layer w0.254: LED8.2 4.44,46.74 6.35,48.64 8.54,48.64 8.67,48.77
$1N26921: length 6.5
  Bottom Layer w0.254: 8.67,54.1 8.54,53.98 6.35,53.98 4.44,52.07 LED9.2
$1N26922: length 6.5
  Bottom Layer w0.254: 8.67,59.44 8.54,59.31 6.35,59.31 4.44,57.4 LED10.2
$1N26923: length 6.5
  Bottom Layer w0.254: LED11.2 4.44,62.74 6.35,64.64 8.54,64.64 8.67,64.77
$1N28420: length 6.5
  Bottom Layer w0.254: LED13.2 4.44,73.41 6.35,75.31 8.54,75.31 8.67,75.44
$1N28421: length 6.5
  Bottom Layer w0.254: 8.67,80.77 8.54,80.65 6.35,80.65 4.44,78.74 LED14.2
$1N28422: length 6.5
  Bottom Layer w0.254: 8.67,86.11 8.54,85.98 6.35,85.98 4.44,84.07 LED15.2
$1N28423: length 6.5
  Bottom Layer w0.254: 3.01,89.41 4.44,89.41 6.35,91.31 8.54,91.31 8.67,91.44
$1N125570: length 11.8
  Top Layer w0.254: 3.54,14.48 3.54,14.72 v1(4.99,16.17) 4.49,16.67 U7.2 2.54,19.3 1.52,18.29 C9.2
  Top Layer w0.508: R10.2 3.66,14.61 3.54,14.72

## Copper pours and planes (outline as drawn; the poured copper is in the pictures)
GND on Top Layer: -3.05,102.36 13.84,102.36 13.84,-3.05 -3.05,-3.05
GND on Bottom Layer: -3.81,102.36 16.26,102.36 16.26,-3.56 -3.81,-3.56

Small or netless copper shapes (teardrops, artwork), in the pictures only: 139 on Top Layer, 202 on Bottom Layer

## Text on the board
Bottom Silkscreen Layer: 5v | GND | JLCJLCJLCJLC
Top Silkscreen Layer: 3v3 | Ver.1.1 Rev.1 / 2022.10.18 | jlywxy | Color SPU Strip
